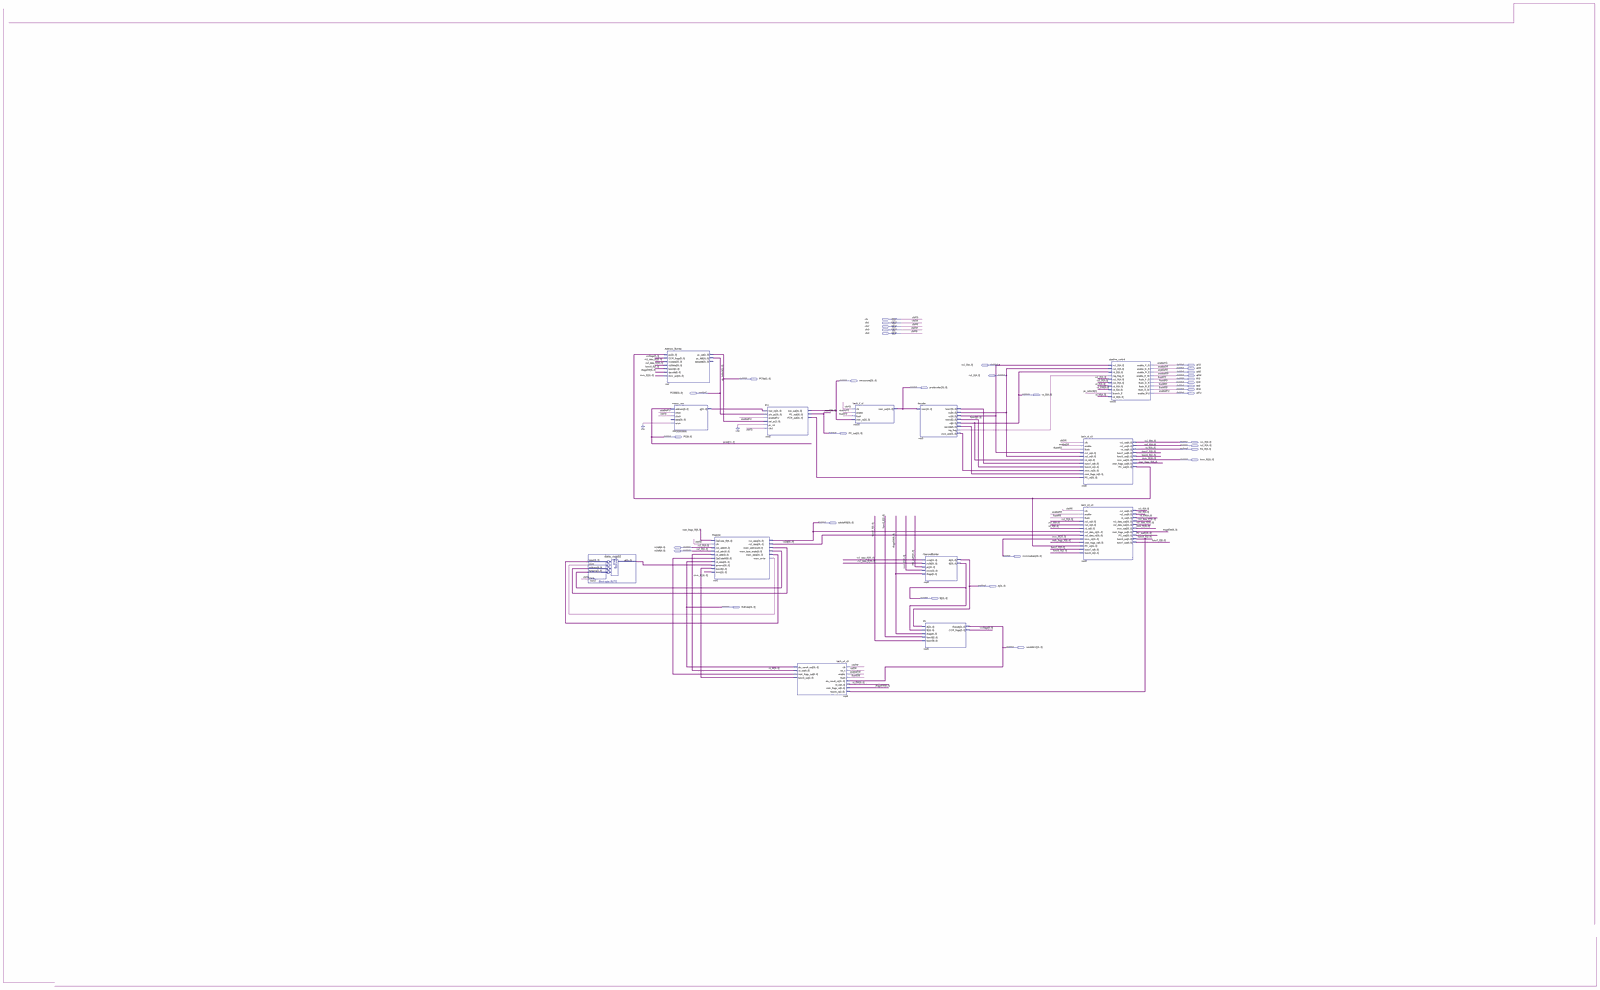
[diagram p0: schematic sheet, whole]
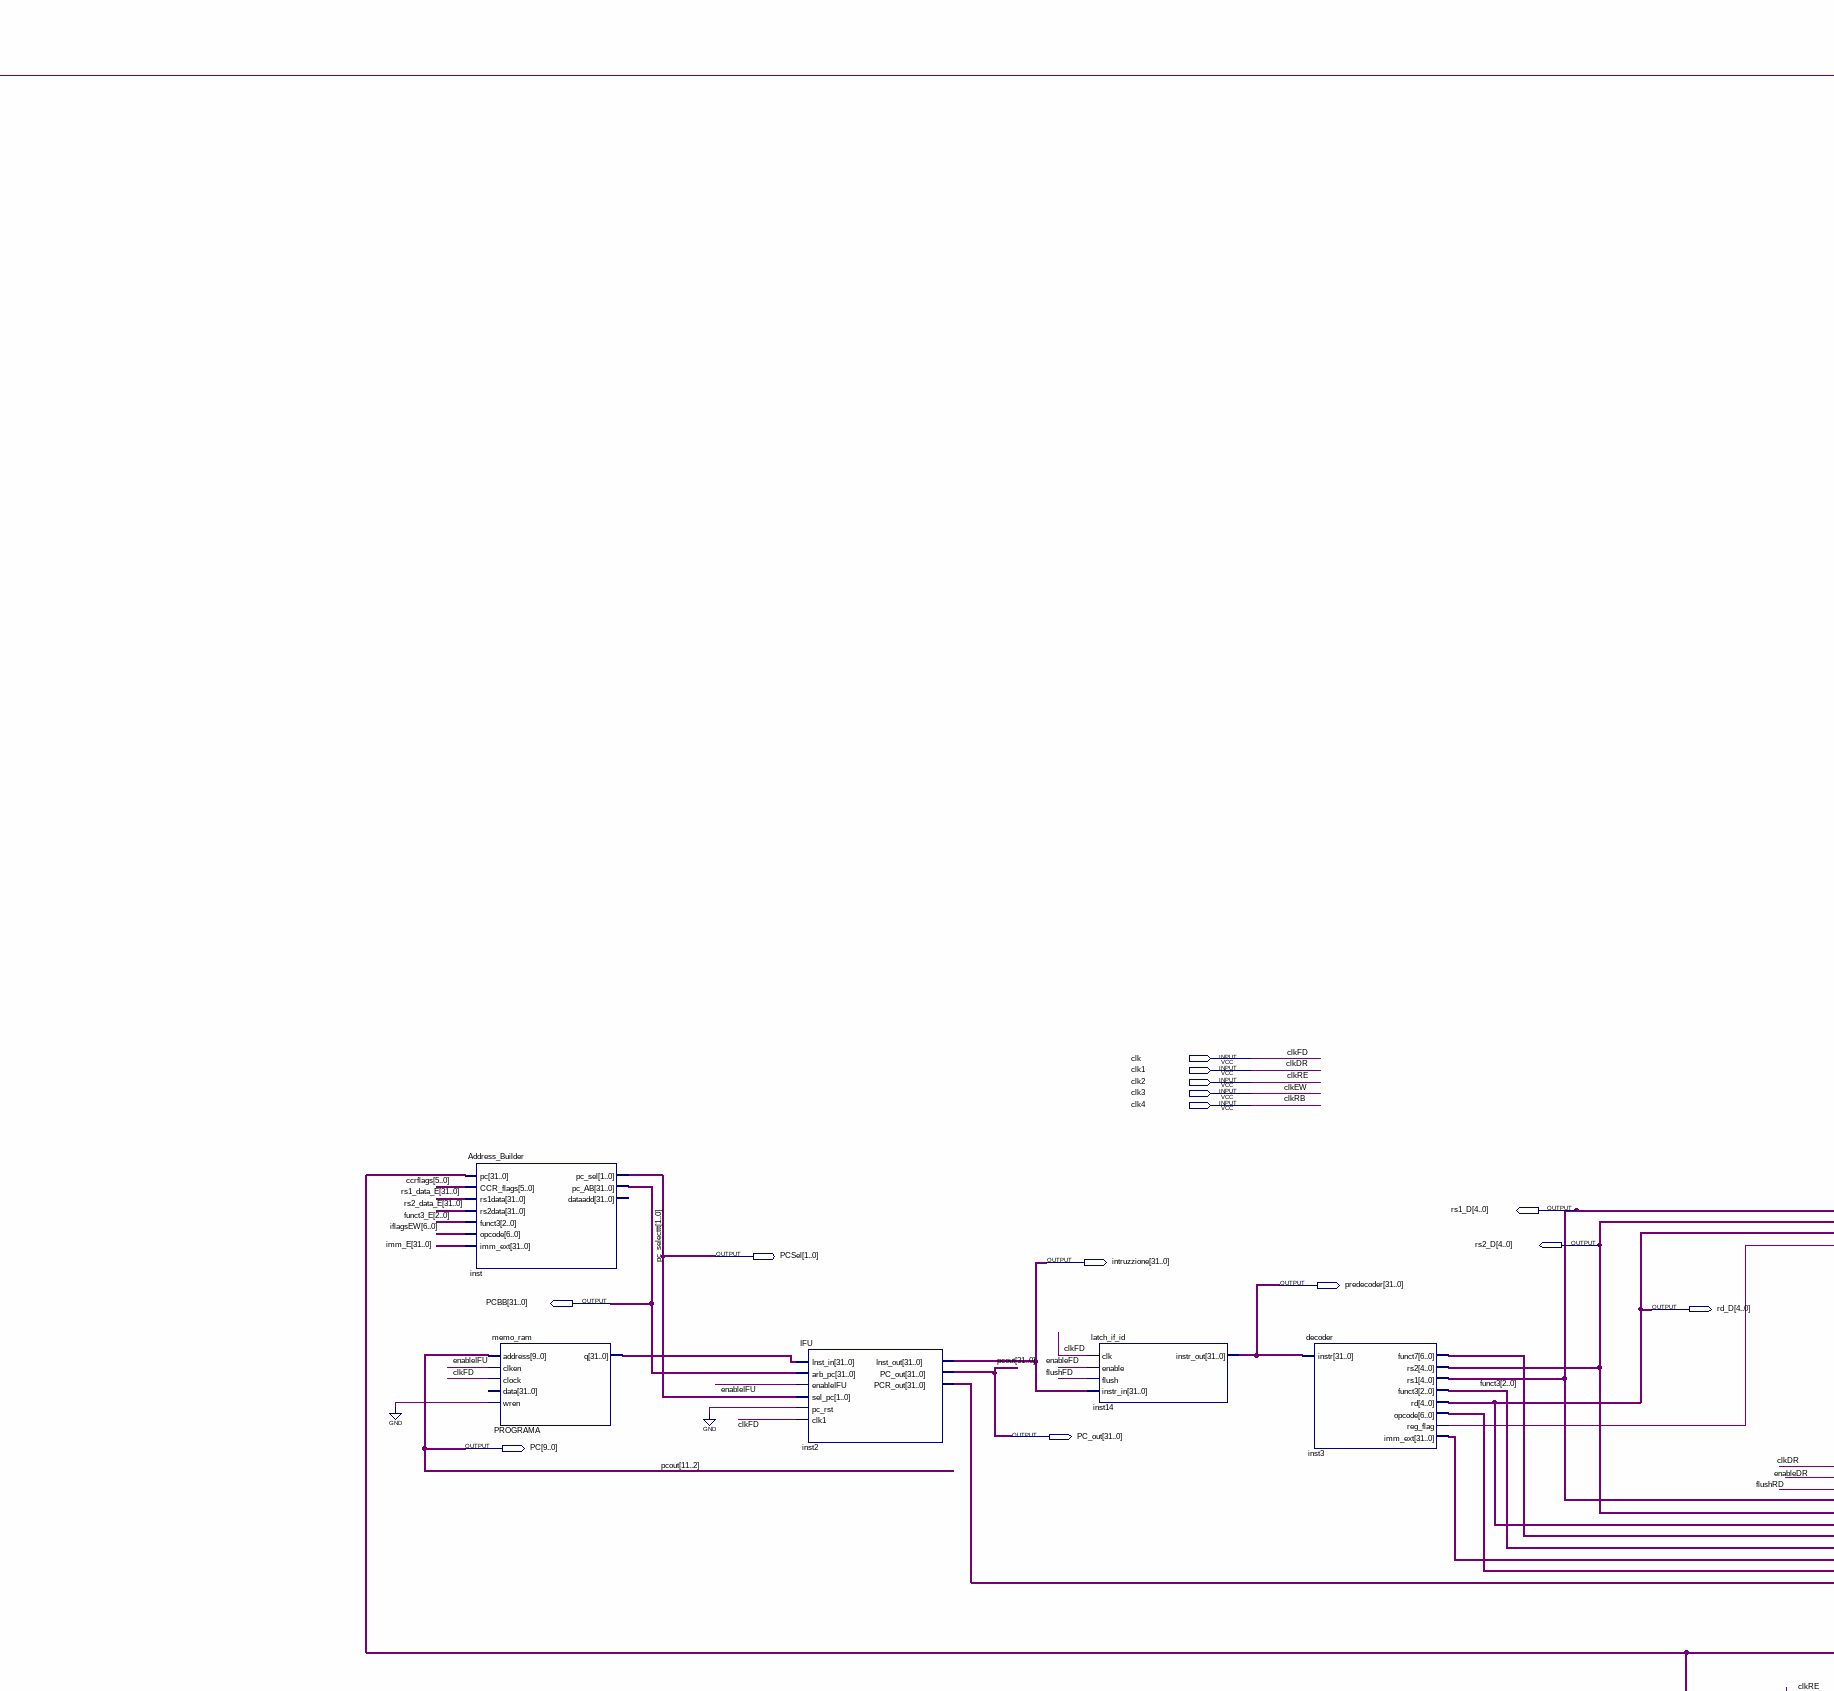
[diagram p1: schematic sheet, upper centre part]
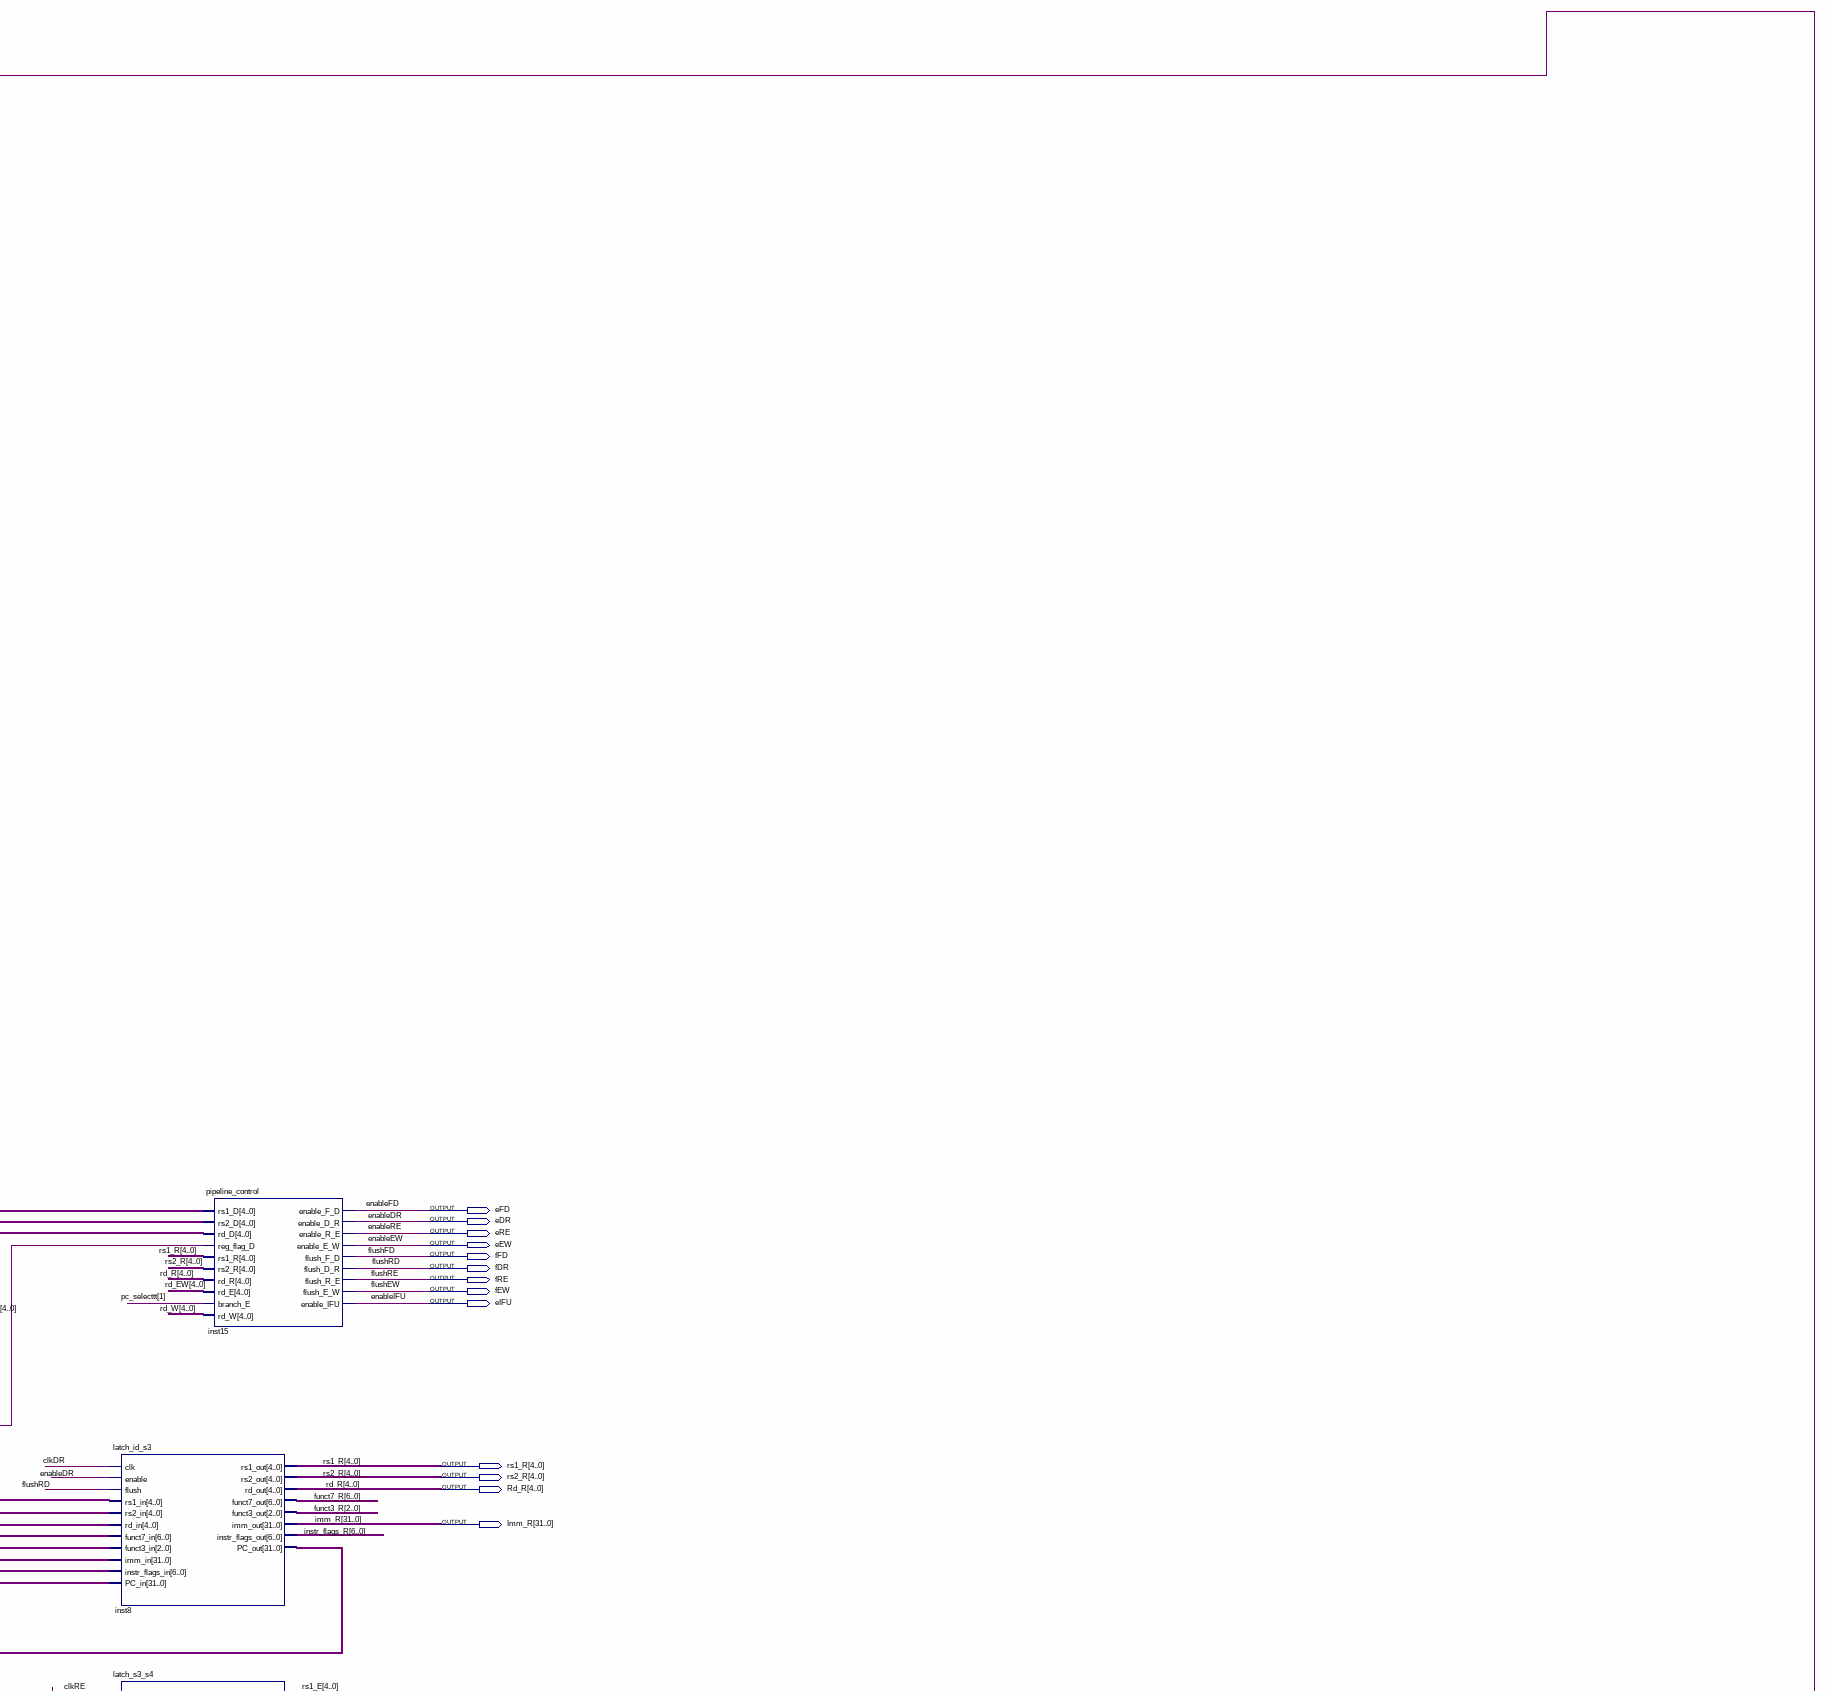
[diagram p2: schematic sheet, upper right part]
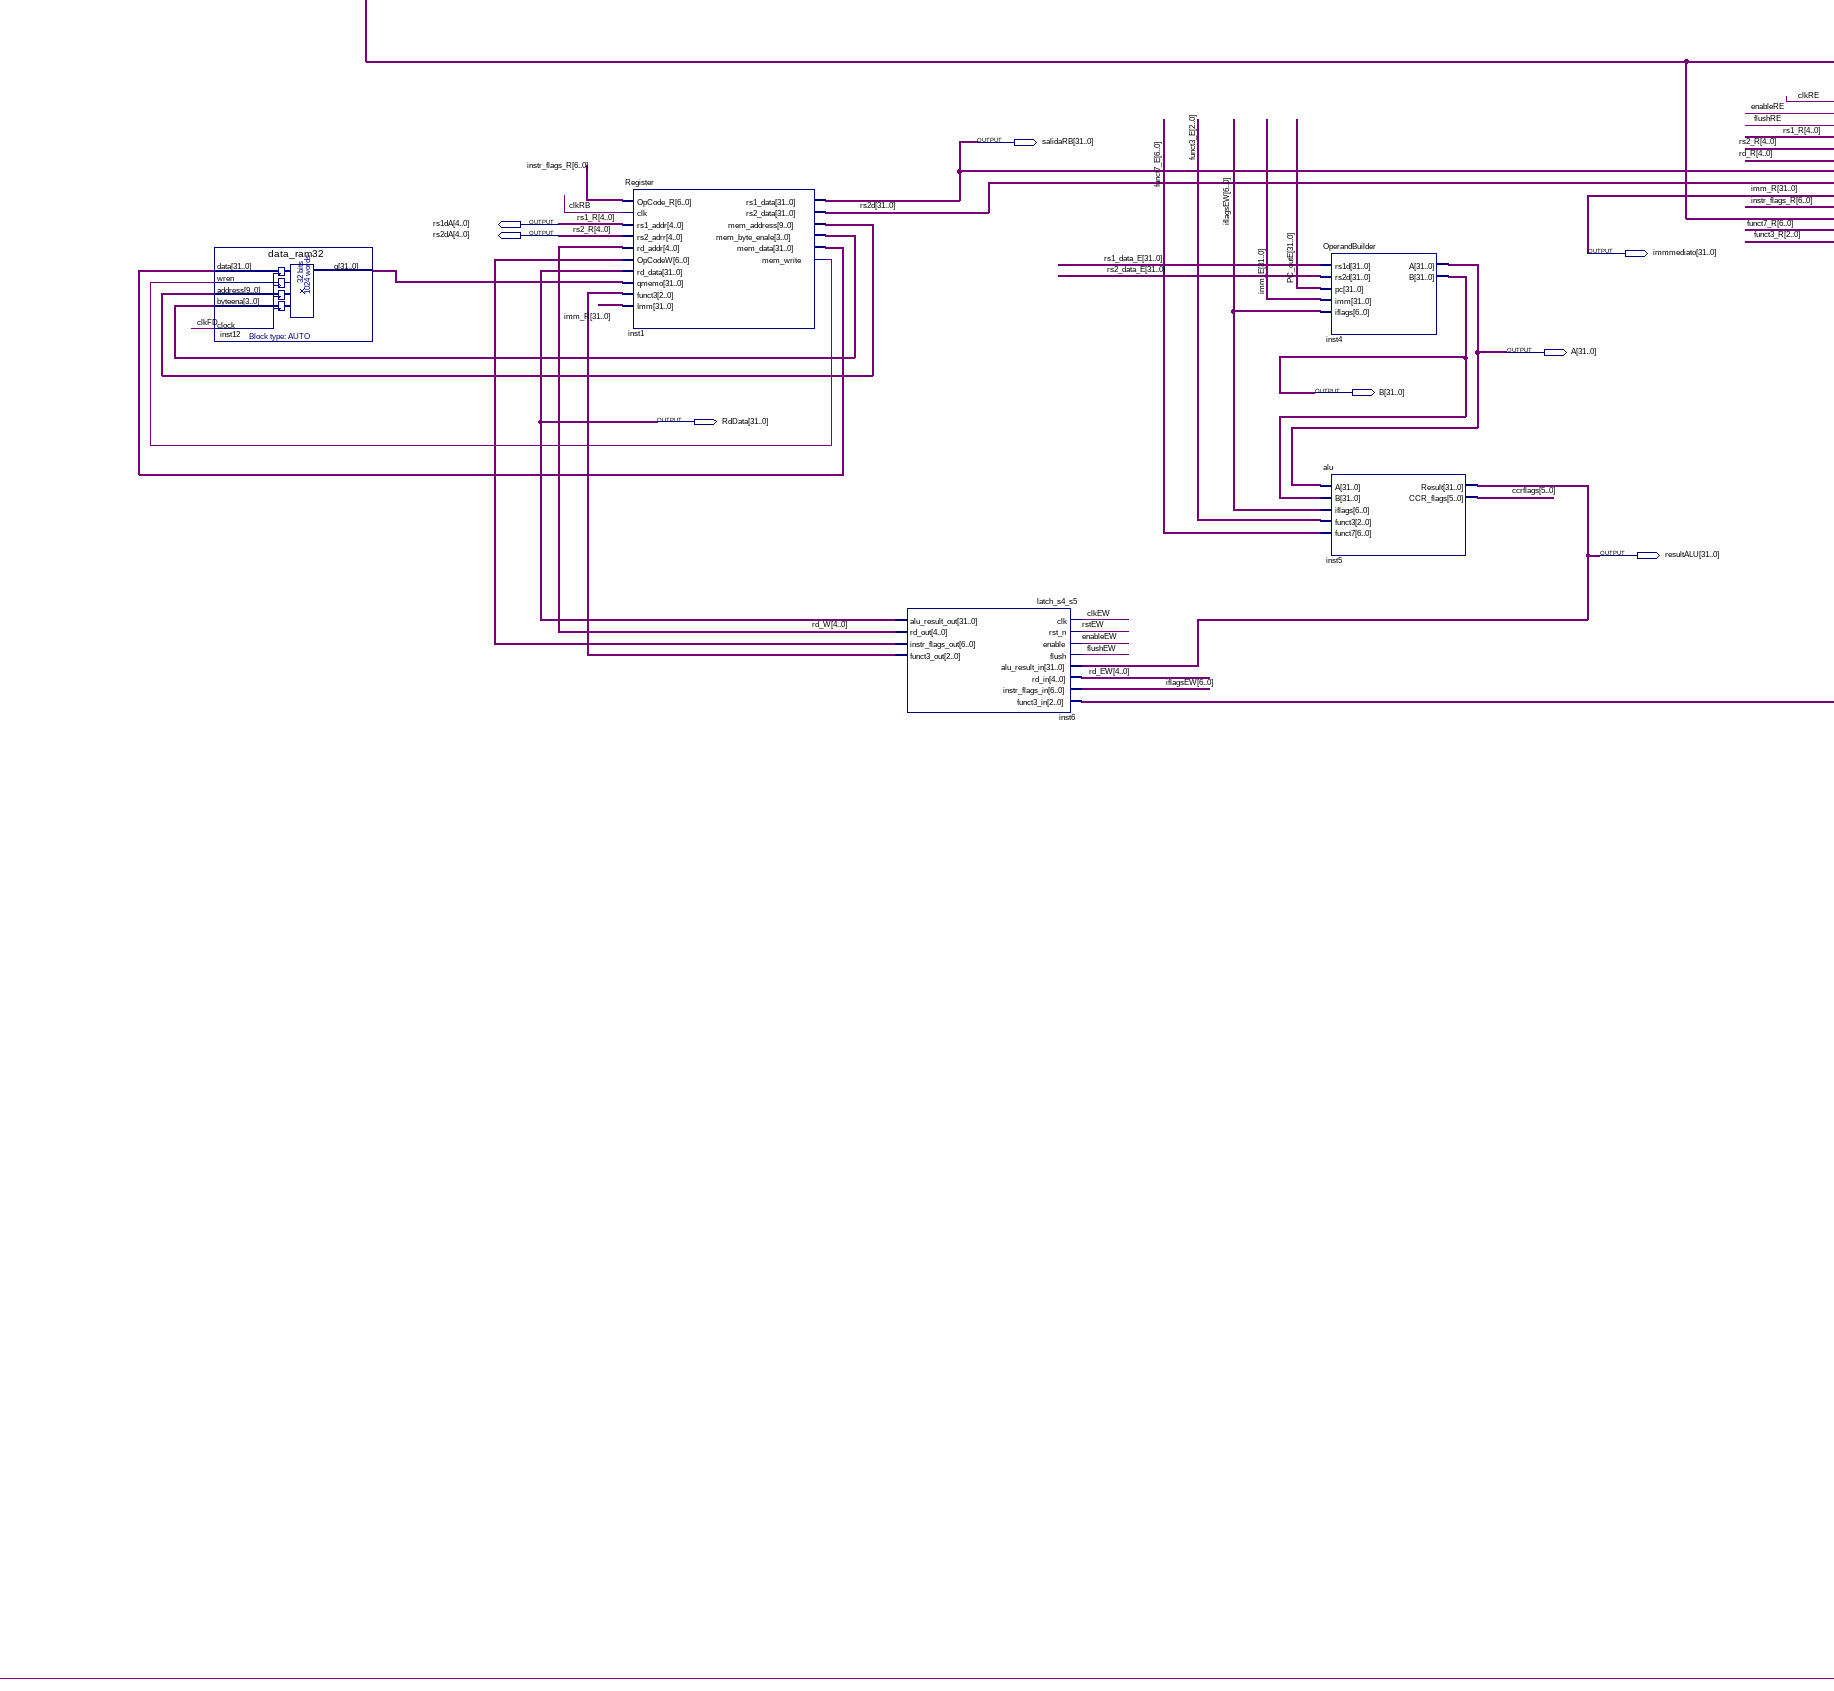
[diagram p3: schematic sheet, lower centre part]
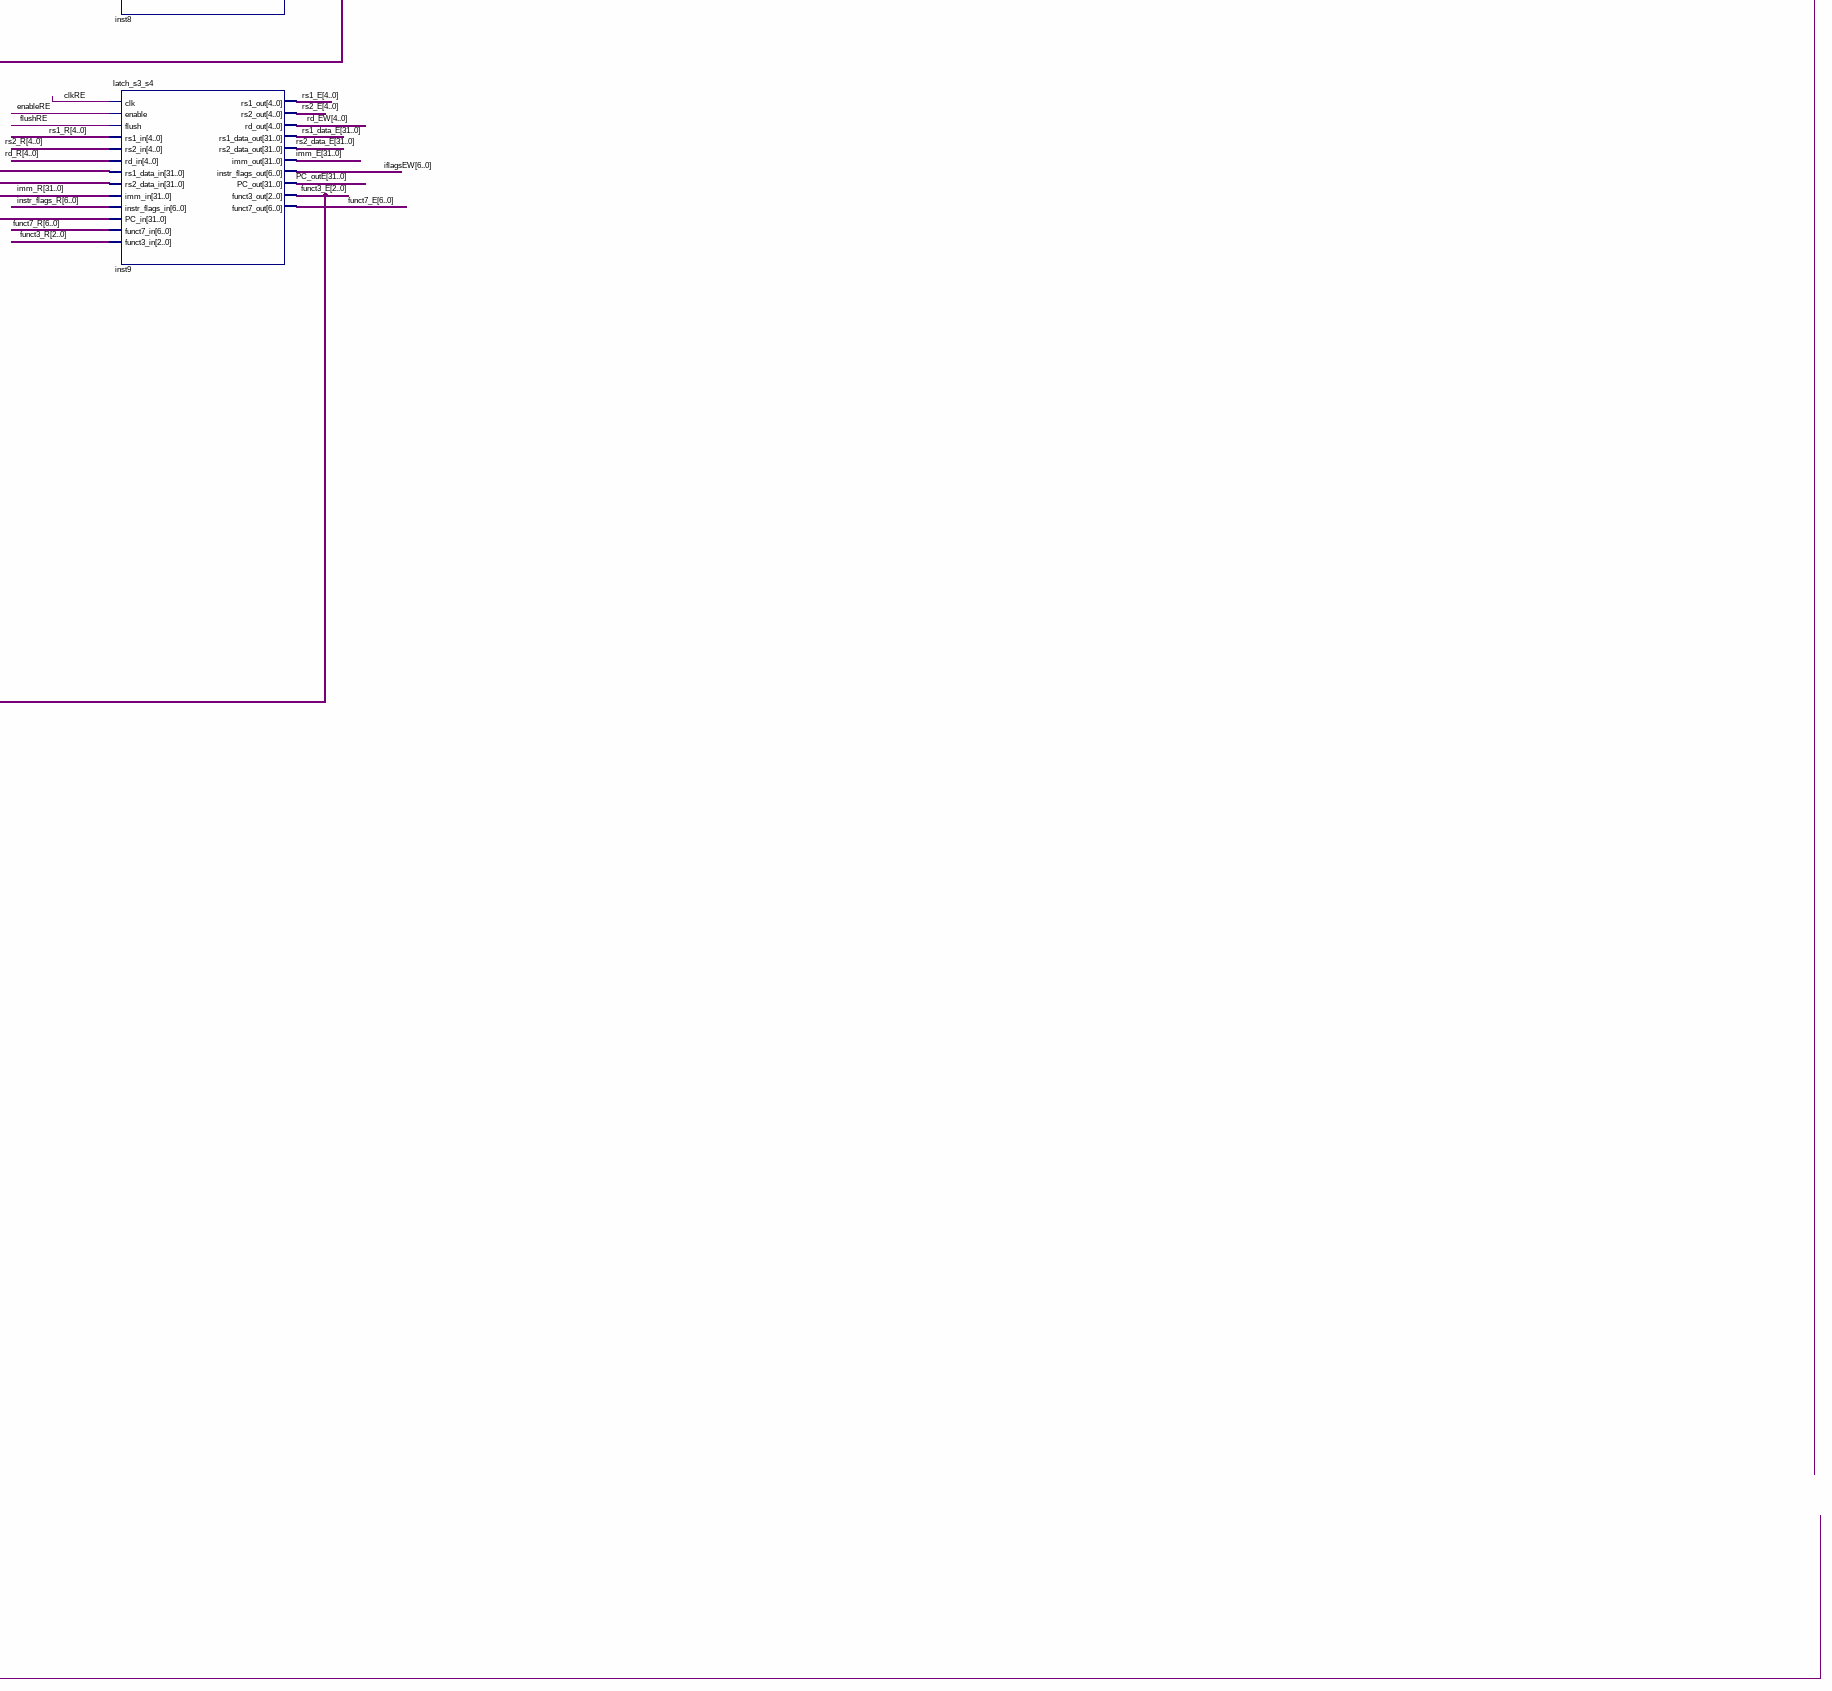
[diagram p4: schematic sheet, lower right part]
// Quartus schematic Main2ahoraespersonal.bdf as structural Verilog: 13 symbols, 35 pins
module Main2ahoraespersonal (
  input  clk,
  input  clk1,
  input  clk2,
  input  clk3,
  input  clk4,
  output [4:0] rs1_D,
  output eFD,
  output eDR,
  output eRE,
  output [4:0] rs2_D,
  output eEW,
  output [1:0] PCSel,
  output fFD,
  output [31:0] intruzzione,
  output fDR,
  output fRE,
  output [31:0] predecoder,
  output fEW,
  output [31:0] PCBB,
  output eIFU,
  output [4:0] rd_D,
  output [31:0] PC_out,
  output [9:0] PC,
  output [4:0] rs1_R,
  output [4:0] rs2_R,
  output [4:0] Rd_R,
  output [31:0] Imm_R,
  output [31:0] salidaRB,
  output [4:0] rs1dA,
  output [4:0] rs2dA,
  output [31:0] immmediato,
  output [31:0] A,
  output [31:0] B,
  output [31:0] RdData,
  output [31:0] resultALU
);

  wire inst1_mem_write, inst3_reg_flag, rstEW;
  wire [2:0] funct3, funct3_E, funct3_R, inst6_funct3_out;
  wire [3:0] inst1_mem_byte_enale;
  wire [4:0] rd_EW, rd_W, rs1_E, rs2_E;
  wire [5:0] ccrflags;
  wire [6:0] funct7_E, funct7_R, iflagsEW, inst3_funct7, inst3_opcode, inst6_instr_flags_out, instr_flags_R;
  wire [9:0] inst1_mem_address;
  wire [31:0] imm_E, inst1_mem_data, inst2_pcr_out, inst3_imm_ext, inst8_pc_out, inst12_q, PC_outE,
       PROGRAMA_q, rs1_data_E, rs2_data_E, rs2d;

  data_ram32 inst12 (
    .data(inst1_mem_data), .wren(inst1_mem_write), .address(inst1_mem_address),
    .byteena(inst1_mem_byte_enale), .clock(clk), .q(inst12_q));
  Address_Builder inst (
    .pc(inst8_pc_out), .CCR_flags(ccrflags), .rs1data(rs1_data_E), .rs2data(rs2_data_E), .funct3(funct3_E),
    .opcode(iflagsEW), .imm_ext(imm_E), .pc_sel(PCSel), .pc_AB(PCBB));  // open: dataadd
  memo_ram PROGRAMA (.address(PC), .clken(eIFU), .clock(clk), .wren(1'b0), .q(PROGRAMA_q));  // open: data
  Register inst1 (
    .OpCode_R(instr_flags_R), .clk(clk4), .rs1_addr(rs1_R), .rs2_adrr(rs2_R), .rd_addr(rd_W),
    .OpCodeW(inst6_instr_flags_out), .rd_data(RdData), .qmemo(inst12_q), .funct3(inst6_funct3_out),
    .Imm(Imm_R), .rs1_data(salidaRB), .rs2_data(rs2d), .mem_address(inst1_mem_address),
    .mem_byte_enale(inst1_mem_byte_enale), .mem_data(inst1_mem_data), .mem_write(inst1_mem_write));
  IFU inst2 (
    .Inst_in(PROGRAMA_q), .arb_pc(PCBB), .enableIFU(eIFU), .sel_pc(PCSel), .pc_rst(1'b0), .clk1(clk),
    .Inst_out(intruzzione), .PC_out({PC_out[31:12], PC, PC_out[1:0]}), .PCR_out(inst2_pcr_out));
  latch_s4_s5 inst6 (
    .clk(clk3), .rst_n(rstEW), .enable(eEW), .flush(fEW), .alu_result_in(resultALU), .rd_in(rd_EW),
    .instr_flags_in(iflagsEW), .funct3_in(funct3_E), .alu_result_out(RdData), .rd_out(rd_W),
    .instr_flags_out(inst6_instr_flags_out), .funct3_out(inst6_funct3_out));
  latch_if_id inst14 (.clk(clk), .enable(eFD), .flush(fFD), .instr_in(intruzzione), .instr_out(predecoder));
  decoder inst3 (
    .instr(predecoder), .funct7(inst3_funct7), .rs2(rs2_D), .rs1(rs1_D), .funct3(funct3), .rd(rd_D),
    .opcode(inst3_opcode), .reg_flag(inst3_reg_flag), .imm_ext(inst3_imm_ext));
  OperandBuilder inst4 (
    .rs1d(rs1_data_E), .rs2d(rs2_data_E), .pc(PC_outE), .imm(imm_E), .iflags(iflagsEW), .A(A), .B(B));
  alu inst5 (
    .A(A), .B(B), .iflags(iflagsEW), .funct3(funct3_E), .funct7(funct7_E), .Result(resultALU),
    .CCR_flags(ccrflags));
  latch_id_s3 inst8 (
    .clk(clk1), .enable(eDR), .flush(fDR), .rs1_in(rs1_D), .rs2_in(rs2_D), .rd_in(rd_D),
    .funct7_in(inst3_funct7), .funct3_in(funct3), .imm_in(inst3_imm_ext), .instr_flags_in(inst3_opcode),
    .PC_in(inst2_pcr_out), .rs1_out(rs1_R), .rs2_out(rs2_R), .rd_out(Rd_R), .funct7_out(funct7_R),
    .funct3_out(funct3_R), .imm_out(Imm_R), .instr_flags_out(instr_flags_R), .PC_out(inst8_pc_out));
  latch_s3_s4 inst9 (
    .clk(clk2), .enable(eRE), .flush(fRE), .rs1_in(rs1_R), .rs2_in(rs2_R), .rd_in(Rd_R),
    .rs1_data_in(salidaRB), .rs2_data_in(rs2d), .imm_in(Imm_R), .instr_flags_in(instr_flags_R),
    .PC_in(inst8_pc_out), .funct7_in(funct7_R), .funct3_in(funct3_R), .rs1_out(rs1_E), .rs2_out(rs2_E),
    .rd_out(rd_EW), .rs1_data_out(rs1_data_E), .rs2_data_out(rs2_data_E), .imm_out(imm_E),
    .instr_flags_out(iflagsEW), .PC_out(PC_outE), .funct3_out(funct3_E), .funct7_out(funct7_E));
  pipeline_control inst15 (
    .rs1_D(rs1_D), .rs2_D(rs2_D), .rd_D(rd_D), .reg_flag_D(inst3_reg_flag), .rs1_R(rs1_R), .rs2_R(rs2_R),
    .rd_R(Rd_R), .rd_E(rd_EW), .branch_E(PCSel[1]), .rd_W(rd_W), .enable_F_D(eFD), .enable_D_R(eDR),
    .enable_R_E(eRE), .enable_E_W(eEW), .flush_F_D(fFD), .flush_D_R(fDR), .flush_R_E(fRE), .flush_E_W(fEW),
    .enable_IFU(eIFU));

  assign immmediato = Imm_R;
  assign PC_out[11:2] = PC;
  assign rs1dA = rs1_R;
  assign rs2dA = rs2_R;

  // Other names for the same wires on the sheet: clkDR = clk1; clkEW = clk3; clkFD = clk; clkRB = clk4; clkRE = clk2;
  //   enableDR = eDR; enableEW = eEW; enableFD = eFD; enableIFU = eIFU; enableRE = eRE; flushEW = fEW; flushFD = fFD;
  //   flushRD = fDR; flushRE = fRE; pcout[31:0] = {PC_out[31:12], PC, PC_out[1:0]}; pc_selecttt[1:0] = PCSel
endmodule
